# EAGLE design McPiFace-BlankSingle (EAGLE 7.4.0)
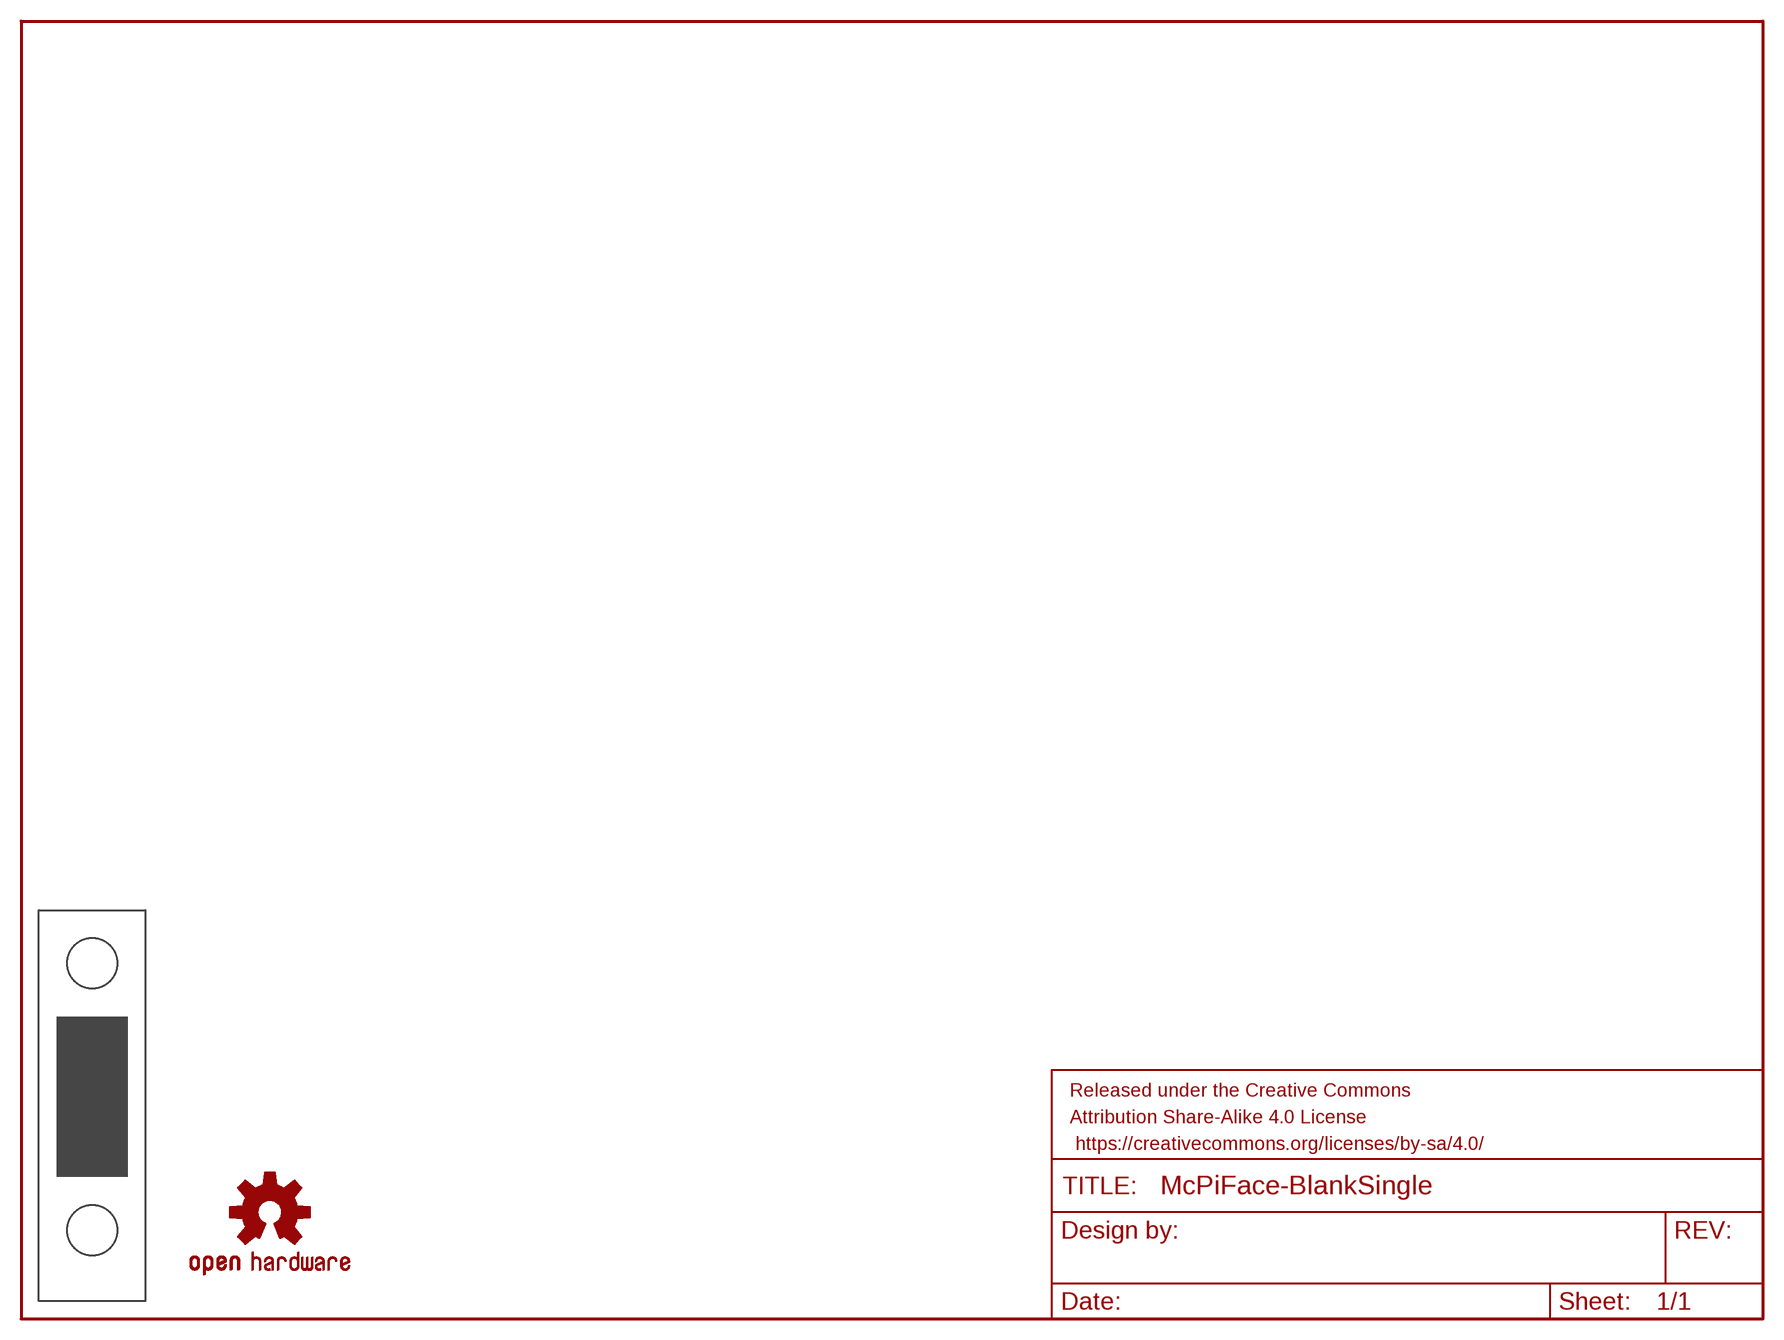
[diagram p0: schematic, sheet 1]

## Parts
FRAME1  FRAME-LETTER  [CREATIVE_COMMONS]
LOGO1  OSHW-LOGOM  [OSHW-LOGO-M]
U$2  MC_PI_FACE_PANELSINGLE_BLANK  [MC_PI_SINGE_BLANK_FACE]

## Library data of the parts
FRAME1 = SparkFun-Aesthetics:FRAME-LETTER: Schematic Frame - Letter Standard 8.5x11 US Letter frame
LOGO1 = SparkFun-Aesthetics:OSHW-LOGO: Open-Source Hardware (OSHW) Logo This logo indicates the piece of hardware it is found on incorporates a OSHW license and/or adheres to the definition of open source hardware found here: http://freedomdefined.org/OSHW
U$2 = McPiFace:MC_PI_FACE_PANEL

## Board
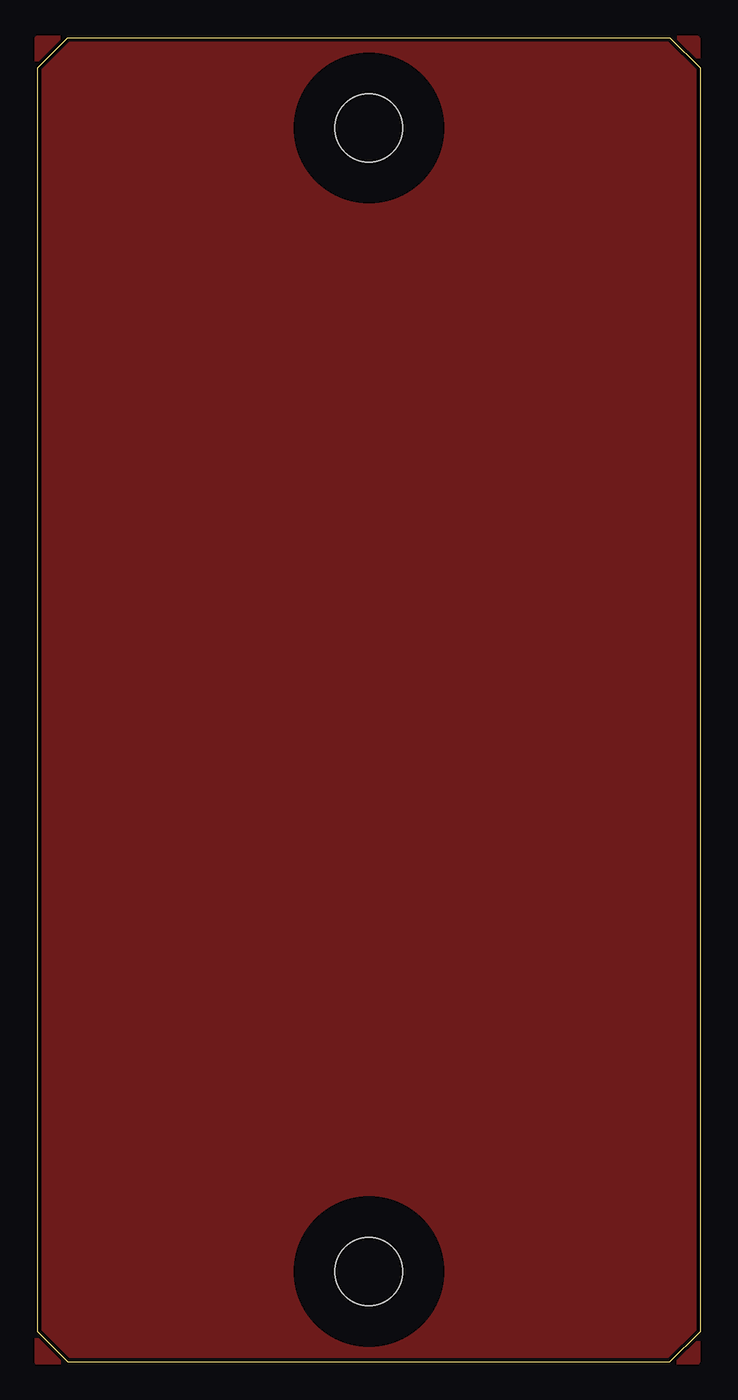
[diagram p1: board, top side]
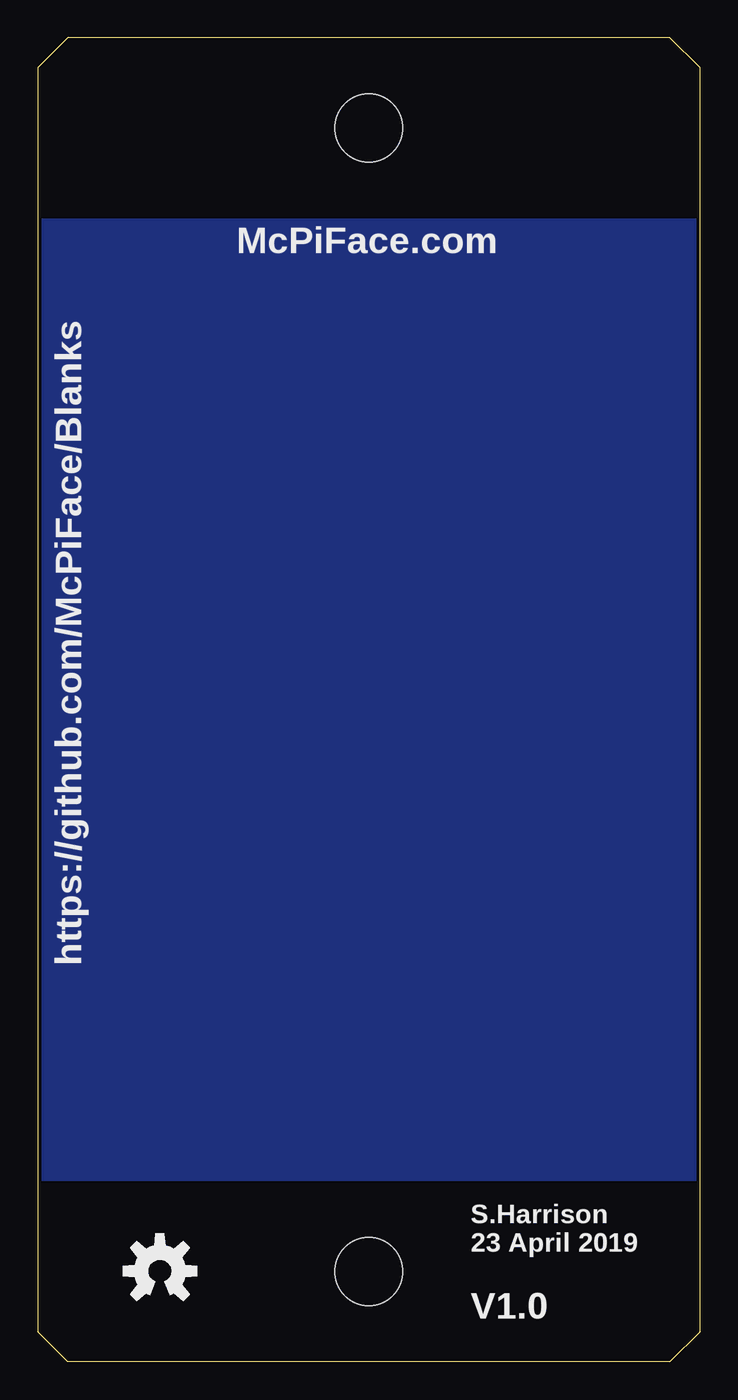
[diagram p2: board, bottom side, seen from below]

Size 44 x 88 mm. Coordinates in mm from the lower left corner, seen from the top.
Copper layers (1*16): Top 0.035mm / dielectric 1.5mm / Bottom 0.035mm
Design rules "dirt_cheap_dirty_boards.v1.1": minimum track width 6mil, minimum drill 12mil, track to track 6mil, track to pad 6mil, pad to pad 6mil, via to via 6mil, smd to smd 0mil, copper to edge 10mil, drill to drill 10mil, minimum pad ring 10mil, minimum via ring 6mil, stop-mask expansion 2mil, vias tented up to drill 25mil, thermal gap 10mil

### Footprints (pad centres in the part's own frame; a part is rotated, then mirrored left to right if it is on the bottom)
MC_PI_SINGE_BLANK_FACE = hole 4.5: 22,6; 22,82

### Placement (x,y rotation side)
FRAME1  9.8,-10.86 0 top  (outside the outline)
LOGO1  35.88,6.03 0 bottom
U$2  0,0 0 top

### Tracks (layer width: path | path; a pad name or v marks a point on that pad's centre or on a via)
N$1
  pour Bottom: 0,87.95 43.81,87.95 43.81,0 0,0
N$2
  pour Top: 0,87.95 43.81,87.95 43.81,0 0,0

### Text on the board
bNames: McPiFace.com | https://github.com/McPiFace/Blanks | S.Harrison / 23 April 2019 | V1.0